# Altium schematic sheet Peripherals.SchDoc
size B
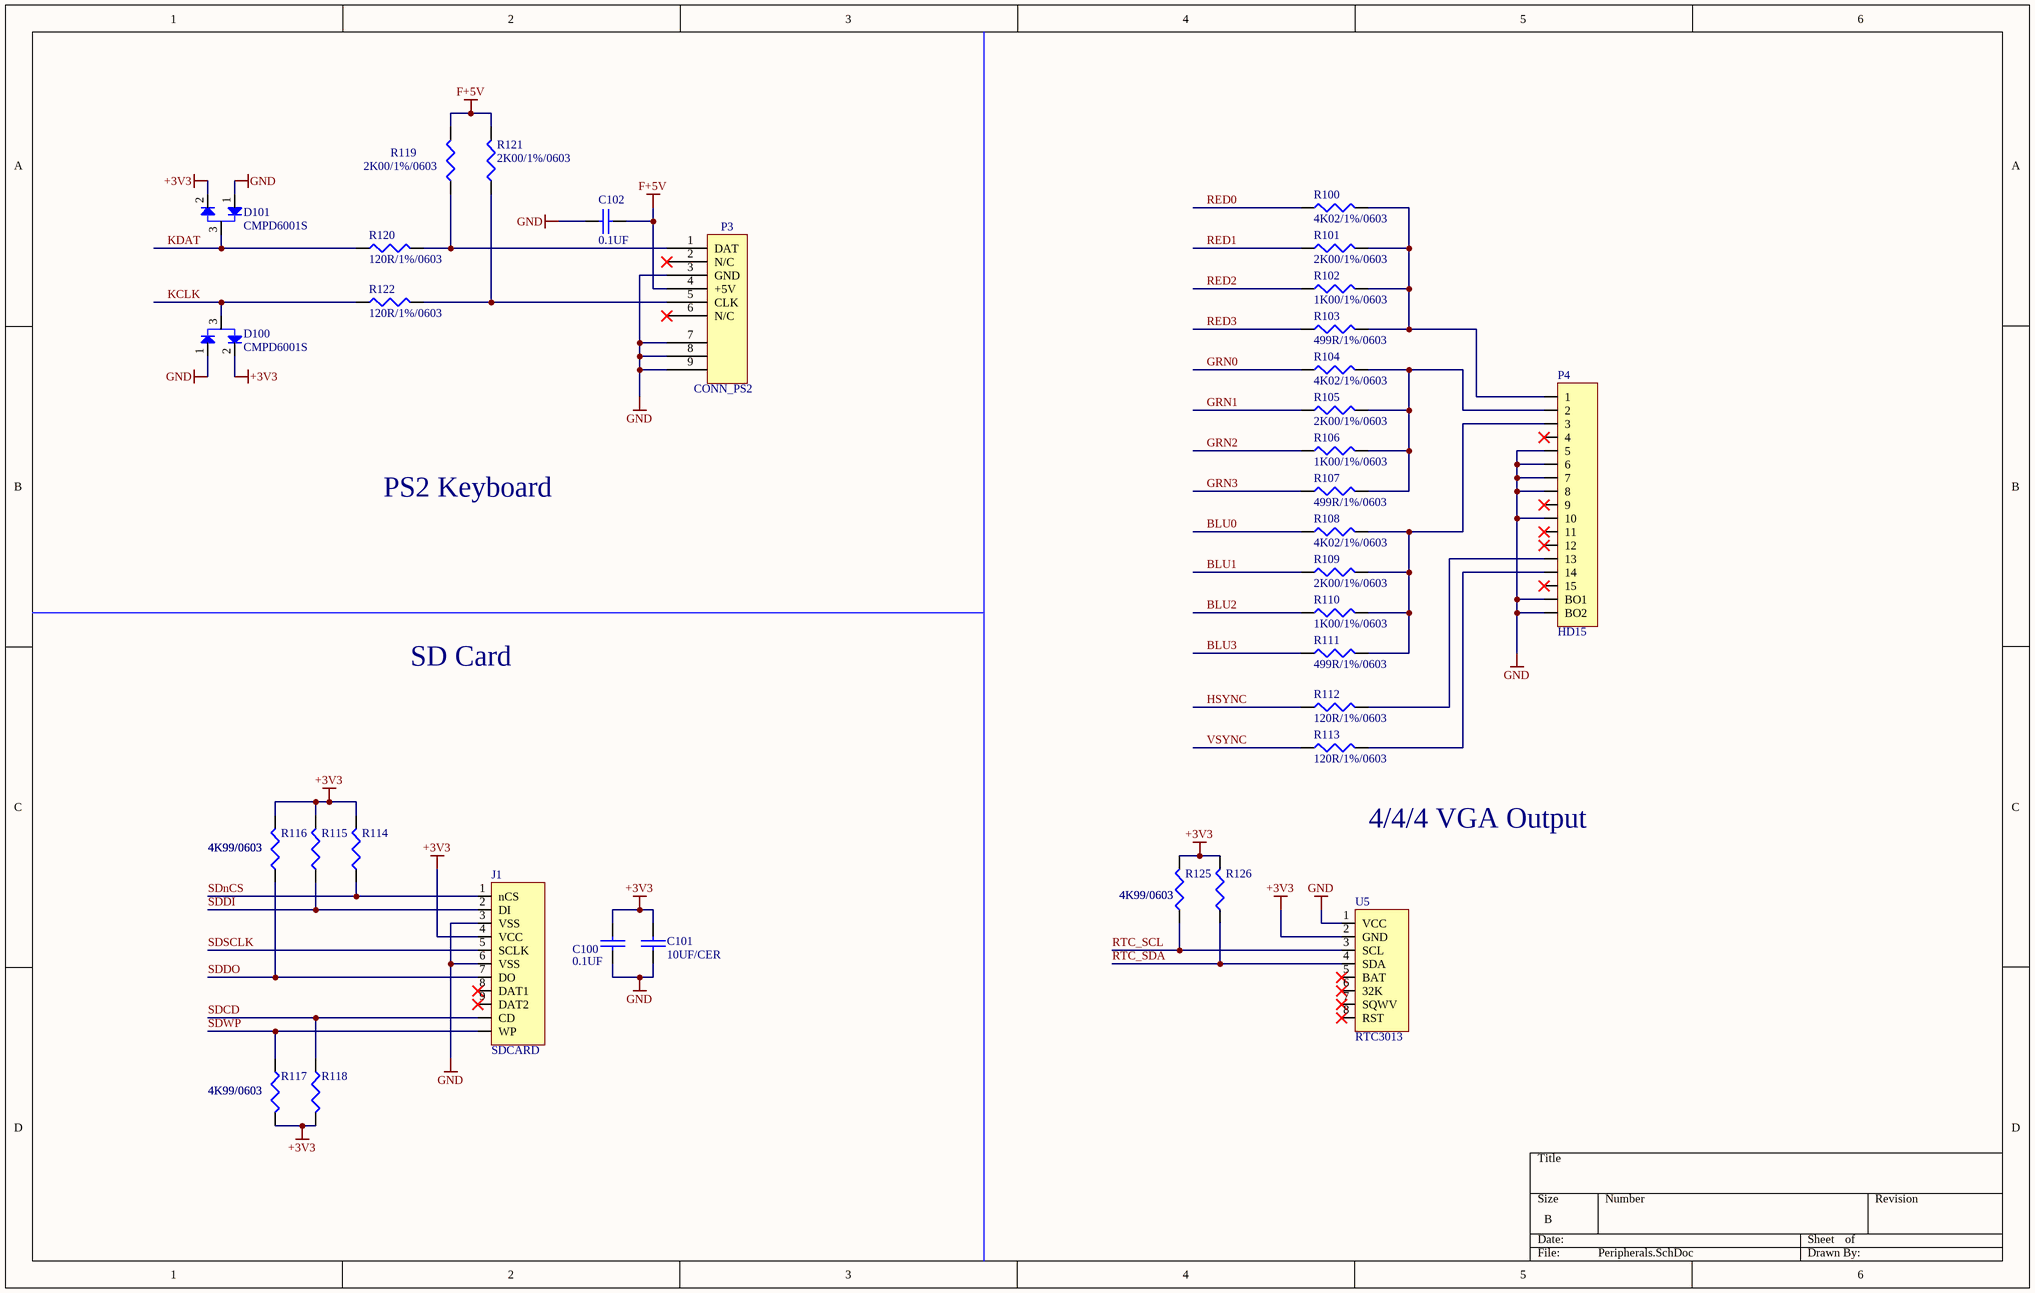
[diagram p0: Peripherals.SchDoc]

## Parts
C100  0.1UF  [0603]
C101  10UF/CER  [0805]
C102  0.1UF  [0603]
D100  CMPD6001S  [SOT-23]
D101  CMPD6001S  [SOT-23]
J1  SDCARD  [SDCARD2041021]
P3  CONN_PS2  [PS2]
P4  HD15  [DB15FLC]
R100  4K02/1%/0603  [0603]
R101  2K00/1%/0603  [0603]
R102  1K00/1%/0603  [0603]
R103  499R/1%/0603  [0603]
R104  4K02/1%/0603  [0603]
R105  2K00/1%/0603  [0603]
R106  1K00/1%/0603  [0603]
R107  499R/1%/0603  [0603]
R108  4K02/1%/0603  [0603]
R109  2K00/1%/0603  [0603]
R110  1K00/1%/0603  [0603]
R111  499R/1%/0603  [0603]
R112  120R/1%/0603  [0603]
R113  120R/1%/0603  [0603]
R114  4K99/0603  [0603]
R115  4K99/0603  [0603]
R116  4K99/0603  [0603]
R117  4K99/0603  [0603]
R118  4K99/0603  [0603]
R119  2K00/1%/0603  [0603]
R120  120R/1%/0603  [0603]
R121  2K00/1%/0603  [0603]
R122  120R/1%/0603  [0603]
R125  4K99/0603  [0603]
R126  4K99/0603  [0603]
U5  RTC3013  [RTC3013]

## Nets
+3V3: C100.1 C101.2 D100.2 D101.2 J1.4(VCC) R114.2 R115.2 R116.2 R117.2 R118.2 R125.2 R126.2 U5.2(GND)
F+5V: C102.2 P3.4(+5V) R119.2 R121.2
GND: C100.2 C101.1 C102.1 D100.1 D101.1 J1.3(VSS) J1.6(VSS) P3.3(GND) P3.7 P3.8 P3.9 P4.5 P4.6 P4.7 P4.8 P4.10 P4.BO1 P4.BO2 U5.1(VCC)
BLU0: R108.1
BLU1: R109.1
BLU2: R110.1
BLU3: R111.1
GRN0: R104.1
GRN1: R105.1
GRN2: R106.1
GRN3: R107.1
HSYNC: R112.1
KCLK: D100.3 R122.1
KDAT: D101.3 R120.1
RED0: R100.1
RED1: R101.1
RED2: R102.1
RED3: R103.1
RTC_SCL: R125.1 U5.3(SCL)
RTC_SDA: R126.1 U5.4(SDA)
SDCD: J1.CD R118.1
SDDI: J1.2(DI) R115.1
SDDO: J1.7(DO) R116.1
SDnCS: J1.1(nCS) R114.1
SDSCLK: J1.5(SCLK)
SDWP: J1.WP R117.1
VSYNC: R113.1
NetP3_1: P3.1(DAT) R119.1 R120.2
NetP3_5: P3.5(CLK) R121.1 R122.2
NetP4_1: P4.1 R100.2 R101.2 R102.2 R103.2
NetP4_2: P4.2 R104.2 R105.2 R106.2 R107.2
NetP4_3: P4.3 R108.2 R109.2 R110.2 R111.2
NetP4_13: P4.13 R112.2
NetP4_14: P4.14 R113.2

Not connected (* = marked no-connect by the designer): J1 8(DAT1)* 9(DAT2)*; P3 2(N/C)* 6(N/C)*; P4 4* 9* 11* 12* 15*; U5 5(BAT)* 6(32K)* 7(SQWV)* 8(RST)*

## Notes on the sheet
- PS2 Keyboard
- SD Card
- 4/4/4 VGA Output

## Library data of the parts
C100 = 0.1UF: CAP .10UF 16V CERAMIC X7R 0603; Text Field1: Kemet; Text Field2: C0603C104K4RACTU; Text Field3: 399-1096-1-ND; Text Field4: 1.17
C101 = 10UF/CER: 10µF ±10% 25V Ceramic Capacitor X7S 0805; Text Field1: Murata; Text Field2: GRM21BC71E106KE11L; Text Field3: 490-10496-1-ND
C102 = 0.1UF: CAP .10UF 16V CERAMIC X7R 0603; MFG: Kemet; MFG PN: C0603C104K4RACTU; DK PN: 399-1096-1-ND; Price: 1.17
D100 D101 = CMPD6001S: Diode Array 1 Pair Series Connection Standard 75V 250mA Surface Mount TO-236-3, SC-59, SOT-23-3; MFG PN: CMPD6001S TR; DK PN: CMPD6001S CT-ND; MFG: Central Semiconductor; FOOTPRINT: SOT23; Populate: *
J1 = SDCARD: 11 (9 + 2) Position Card Connector Secure Digital - SD Surface Mount, Right Angle Gold; MFG: TE; MFG PN: 2041021-4; DK PN: A101492CT-ND; Price: 3.69
P3 = CONN_PS2: 6 Position Circular Connector Receptacle, Female Sockets Solder Silver; MFG: CUI; MFG PN: MD-60SMK; DK PN: CP-4060-ND
P4 = HD15: CONN DSUB HD RCPT 15POS R/A SLDR; Text Field1: Amphenol; Text Field2: ICD15S13E4GX00LF; Text Field3: 609-5181-ND
R100 R104 R108 = 4K02/1%/0603: 4.02 kOhms ±1% 0.1W, 1/10W Chip Resistor 0603 (1608 Metric) Moisture Resistant Thick Film; MFG: Yeago; MFG PN: RC0603FR-074K02L; DK PN: 311-4.02KHRCT-ND
R101 R105 R109 R119 R121 = 2K00/1%/0603: 2 kOhms ±1% 0.1W, 1/10W Chip Resistor 0603 (1608 Metric) Moisture Resistant Thick Film; MFG: Yeago; MFG PN: RC0603FR-072KL; DK PN: 311-2.00KHRCT-ND
R102 R106 R110 = 1K00/1%/0603: 1 kOhms ±1% 0.1W, 1/10W Chip Resistor 0603 (1608 Metric) Moisture Resistant Thick Film; MFG: Yeago; MFG PN: RC0603FR-071KL; DK PN: 311-1.00KHRCT-ND
R103 R107 R111 = 499R/1%/0603: 499 Ohms ±1% 0.1W, 1/10W Chip Resistor 0603 (1608 Metric) Moisture Resistant Thick Film; MFG: Yeago; MFG PN: RC0603FR-07499RL; DK PN: 311-499HRCT-ND
R112 R113 R120 R122 = 120R/1%/0603: 120 Ohms ±1% 0.1W, 1/10W Chip Resistor 0603 (1608 Metric) Moisture Resistant Thick Film; MFG: Yaego; MFG PN: RC0603FR-07120RL; DK PN: 311-120HRCT-ND
R114-R118 R125 R126 = 4K99/0603: RES 4.99K OHM 1/10W 1% 0603 SMD; MFG: Dale/Vishay; MFG PN: CRCW06034K99FKEAC; DK PN: 541-3985-1-ND; Price: 5.02
U5 = RTC3013: DS3231 Real Time Clock (RTC) Timing Evaluation Board; MFG: AdaFruit; MFG PN: 3013; DK PN: 1528-1598-ND; Price: 1.17